# Altium project ETHERNET SWITCH LAYER 2.PrjPcb
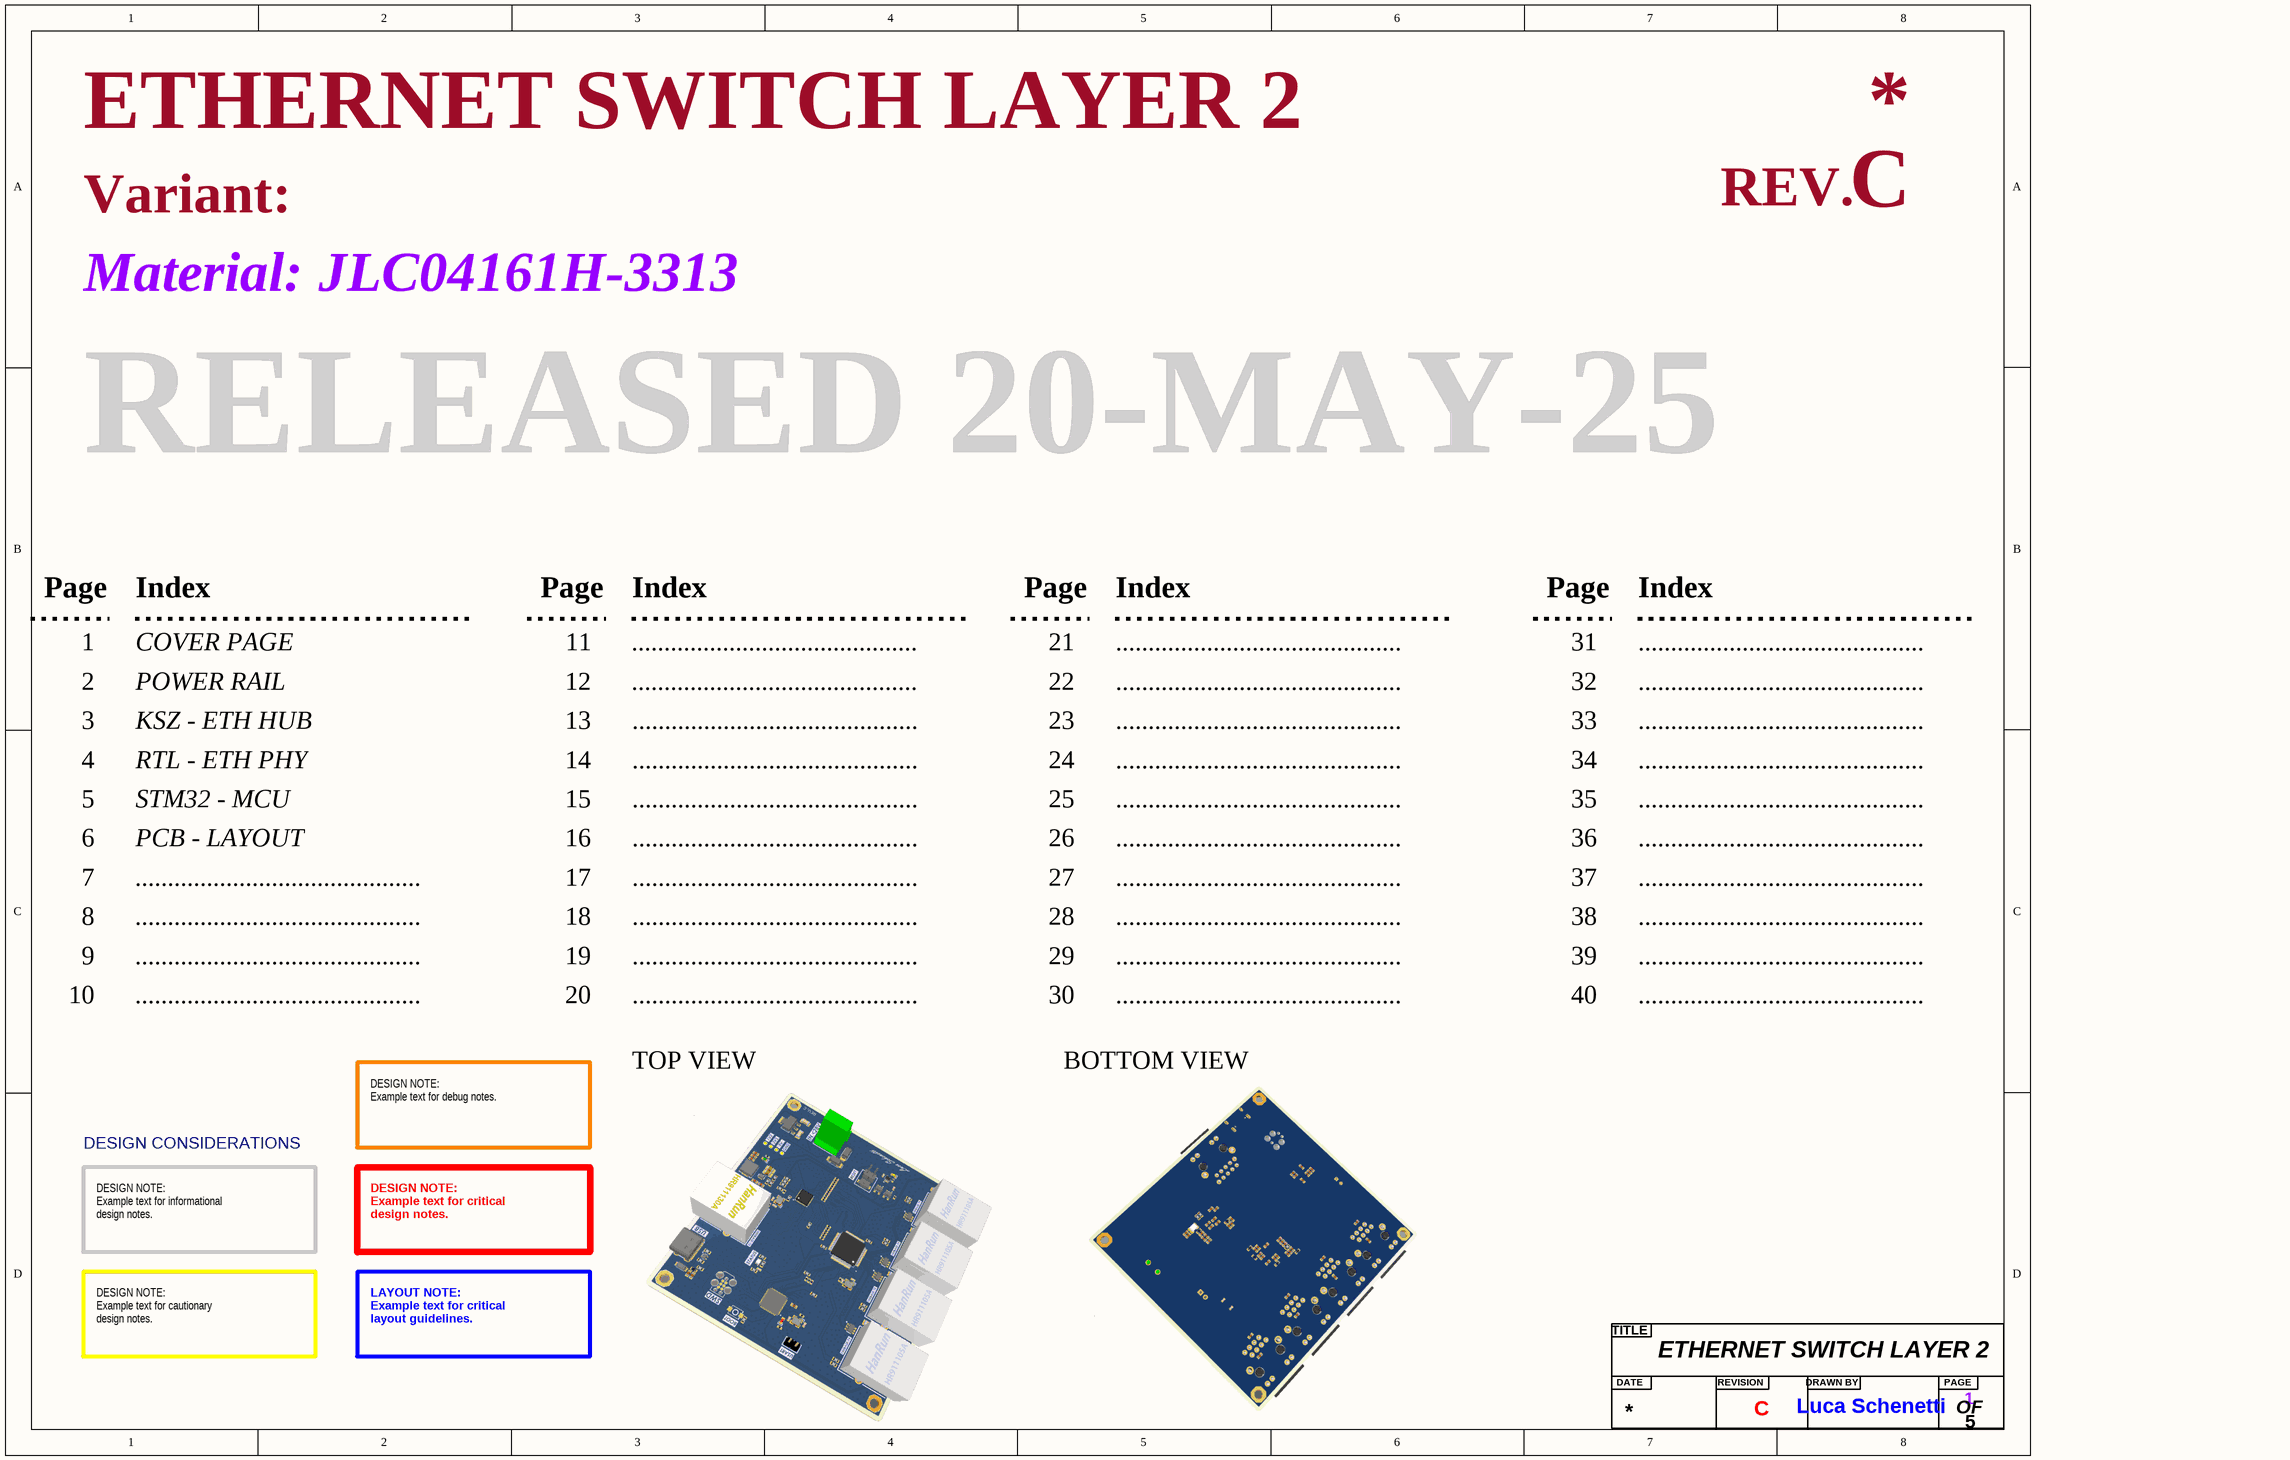
[diagram p0: COVER PAGE.SchDoc]
5 sheets, 184 parts. Net scope: flat (ports and power ports of the same name join across sheets).
Board file: PCB - LAYOUT.PcbDoc
Sheets:
  COVER PAGE.SchDoc
  POWER RAIL.SchDoc
  KSZ - ETH HUB.SchDoc
  RTL - ETH PHY.SchDoc
  STM32 - MCU.SchDoc

## Sheet COVER PAGE.SchDoc: ETHERNET SWITCH LAYER 2
size A3; DrawnBy: Luca Schenetti; Revision: C; SheetNumber: 1; SheetTotal: 5; Material: JLC04161H-3313

### Parts
(Parts that share a designator on the sheet are numbered #1, #2 ... from top to bottom, then left to right.)
?#1  Title  (value not drawn)  (graphical)

### Notes on the sheet
- Variant:
- REV.
- Material:
- RELEASED 20-MAY-25
- Page
- Index
- 1
- 2
- COVER PAGE
- POWER RAIL
- 11
- 12
- ............................................
- 21
- 22
- 31
- 32
- 3
- KSZ - ETH HUB
- 13
- 23
- 33
- 4
- 5
- RTL - ETH PHY
- STM32 - MCU
- 14
- 15
- 24
- 25
- 34
- 35
- 6
- 7
- PCB - LAYOUT
- 16
- 17
- 26
- 27
- 36
- 37
- 8
- 18
- 28
- 38
- 9
- 10
- 19
- 20
- 29
- 30
- 39
- 40
- TOP VIEW
- BOTTOM VIEW
- DESIGN CONSIDERATIONS
- DESIGN NOTE:
  Example text for debug notes.
- DESIGN NOTE:
  Example text for informational
  design notes.
- DESIGN NOTE:
  Example text for critical
  design notes.
- DESIGN NOTE:
  Example text for cautionary
  design notes.
- LAYOUT NOTE:
  Example text for critical
  layout guidelines.
- (in symbol Title) TITLE; DATE; REVISION; DRAWN BY; PAGE; OF

## Sheet POWER RAIL.SchDoc: ETHERNET SWITCH LAYER 2
size A4; DrawnBy: Luca Schenetti; Revision: C; SheetNumber: 2; SheetTotal: 5
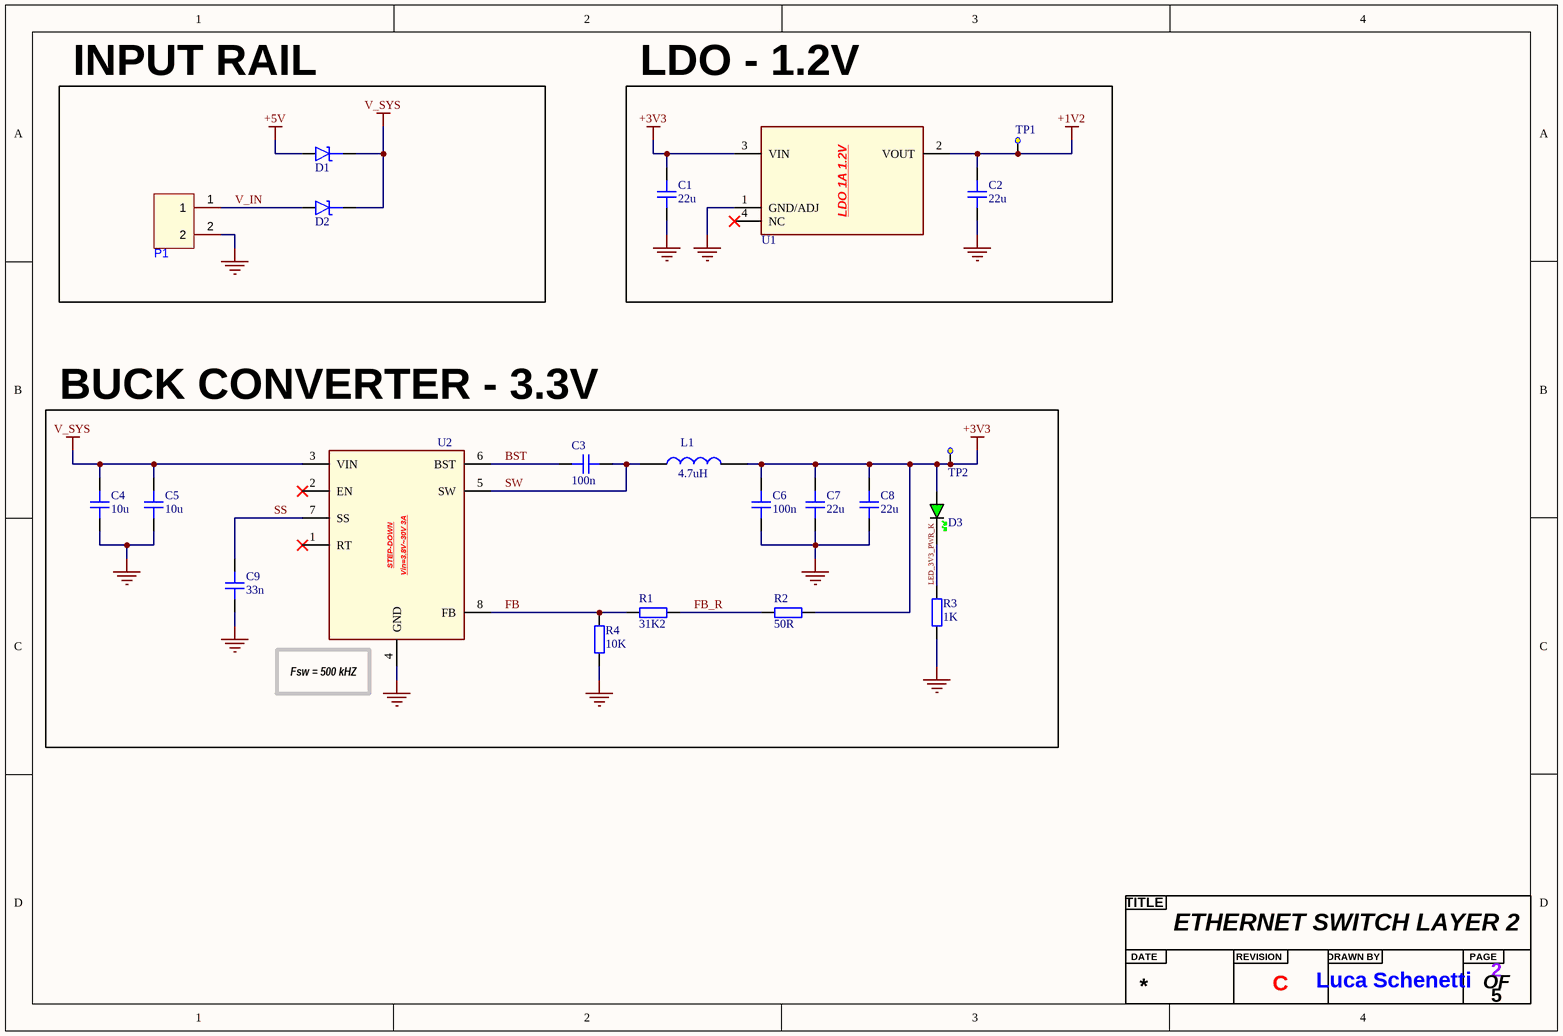
[diagram p1: POWER RAIL.SchDoc]

### Parts
(Parts that share a designator on the sheet are numbered #1, #2 ... from top to bottom, then left to right.)
?#2  Title  (value not drawn)  (graphical)
C1  22u  [CAP_1206]
C2  22u  [CAP_1206]
C3  100n  [CAP_0603]
C4  10u  [CAP_0805]
C5  10u  [CAP_0805]
C6  100n  [CAP_0603]
C7  22u  [CAP_0603]
C8  22u  [CAP_0603]
C9  33n  [CAP_0603]
D1  40V 3A SMA(DO-214AC)  [SS34]  (value not drawn)
D2  40V 3A SMA(DO-214AC)  [SS34]  (value not drawn)
D3  GREEN  [LED_0603_GREEN]  (value not drawn)
L1  4.7uH  [FXL0530-4R7-M]
P1  WJ500V-5.08-2P  [CONN-TH_2P-P5.00_WJ500V-5.08-2P]  (value not drawn)
R1  31K2  [RES_0603]
R2  50R  [RES_0603]
R3  1K  [RES_0402]
R4  10K  [RES_0603]
TP1  Test Point  [Test Point]  (value not drawn)
TP2  Test Point  [Test Point]  (value not drawn)
U1  LDO 1A 1.2V  [AMS1117-1.2]  (value not drawn)
U2  Step Down Converter 3A 3.8V~30V  [TPS62933DRLR]  (value not drawn)

### Blocks framed on the sheet
BUCK CONVERTER - 3.3V: C3-C9 D3 L1 R1-R4 TP2 U2

### Nets
+1V2: C2.2 TP1.1(Test_Point) U1.2(VOUT)
+3V3: C1.2 C6.1 C7.2 C8.2 D3.A L1.2 R2.1 TP2.1(Test_Point) U1.3(VIN)
+5V: D1.A
GND: C1.1 C2.1 C4.1 C5.1 C6.2 C7.1 C8.1 C9.2 P1.2 R3.1 R4.1 U1.1(GND/ADJ) U2.4(GND)
V_SYS: C4.2 C5.2 D1.K D2.K U2.3(VIN)
BST: C3.2 U2.6(BST)
FB: R1.2 R4.2 U2.8(FB)
FB_R: R1.1 R2.2
LED_3V3_PWR_K: D3.K R3.2
SS: C9.1 U2.7(SS)
SW: C3.1 L1.1 U2.5(SW)
V_IN: D2.A P1.1

Not connected (* = marked no-connect by the designer): U1 4(NC)*; U2 1(RT)* 2(EN)*

### Notes on the sheet
- INPUT RAIL
- LDO - 1.2V
- (near U2) Fsw = 500 kHZ
- (in symbol Title) TITLE; DATE; REVISION; DRAWN BY; PAGE; OF
- (in symbol TPS62933DRLR) STEP-DOWN; Vin=3.8V~30V 3A

### Library data of the parts
C1 C2 = CAP_1206: [C12891]; Manufacturer: *; Manufacturer Part Number: *; Distributor Link: *; LCSC: *; Rating: *; Dielectric: *
C3 C6 = CAP_0603: Capacitor SMD 0603 [C14663]; Manufacturer: *; Manufacturer Part Number: *; Distributor Link: *; LCSC: *; Rating: *; Dielectric: *
C4 C5 = CAP_0805: Capacitor SMD 0805[C440198]; Manufacturer: *; Manufacturer Part Number: *; Distributor Link: *; LCSC: *; Rating: *; Dielectric: *
C7 C8 = CAP_0603: Capacitor SMD 0603 [C59461]; Manufacturer: *; Manufacturer Part Number: *; Distributor Link: *; LCSC: *; Rating: *; Dielectric: *
C9 = CAP_0603: [C21117]; Manufacturer: *; Manufacturer Part Number: *; Distributor Link: *; LCSC: *; Rating: *; Dielectric: *
D1 D2 = SS34: [C8678]
D3 = LED_0603_GREEN: LED 0603 GREEN SMD[C2986059]
L1 = FXL0530-4R7-M: [C177246]
P1 = WJ500V-5.08-2P: [C8465]; Manufacturer: KANGNEX(康奈克斯电气); Symbol: WJ500V-5.08-2P-14-00A; Add into BOM: yes; Structure: 1x2P; Pitch: 5.08mm; Current Rating (Max): 18A; Voltage Rating (Max): 250V; Wire Gauge - AWG: 14~30; Wire Gauge - mm2: 2.5; Number of PINs Per Row: 2; Screw Specification: M2.5; Device: WJ500V-5.08-2P; LCSC Part Name: 1x2P 5.08mm 直插 排数:1 每排P数:2; Supplier Part: C8465; Manufacturer Part: WJ500V-5.08-2P; Supplier Footprint: 插件,P=5.08mm; JLCPCB Part Class: Extended Part; Datasheet: https://atta.szlcsc.com/upload/public/pdf/source/20191225/C8465_02D34CE5B5B4A53DF5891601D97FA9F4.pdf; Supplier: LCSC; Convert to PCB: yes; Color: Green; Mounting Style: Straight; Number of Pins: 2P; Number of Rows: 1; Contact Material: -; Contact Plating: -; Operating Temperature Range: -40℃~+105℃; Soldering Temperature(Max): -
R1 = RES_0603: [C863036]; Manufacturer: *; Manufacturer Part Number: *; Distributor Link: *; LCSC: *
R2 = RES_0603: [C849792]; Manufacturer: *; Manufacturer Part Number: *; Distributor Link: *; LCSC: *
R3 = RES_0402: Resistor SMD 0402 [C11702]; Manufacturer: *; Manufacturer Part Number: *; Distributor Link: *; LCSC: *
R4 = RES_0603: [C25804]; Manufacturer: *; Manufacturer Part Number: *; Distributor Link: *; LCSC: *
U1 = AMS1117-1.2: [C347218]
U2 = TPS62933DRLR: [C3200405]
TP1 TP2 = Test Point: Value: Test Point

## Sheet KSZ - ETH HUB.SchDoc: ETHERNET SWITCH LAYER 2
size A2; DrawnBy: Luca Schenetti; Revision: C; SheetNumber: 3; SheetTotal: 5
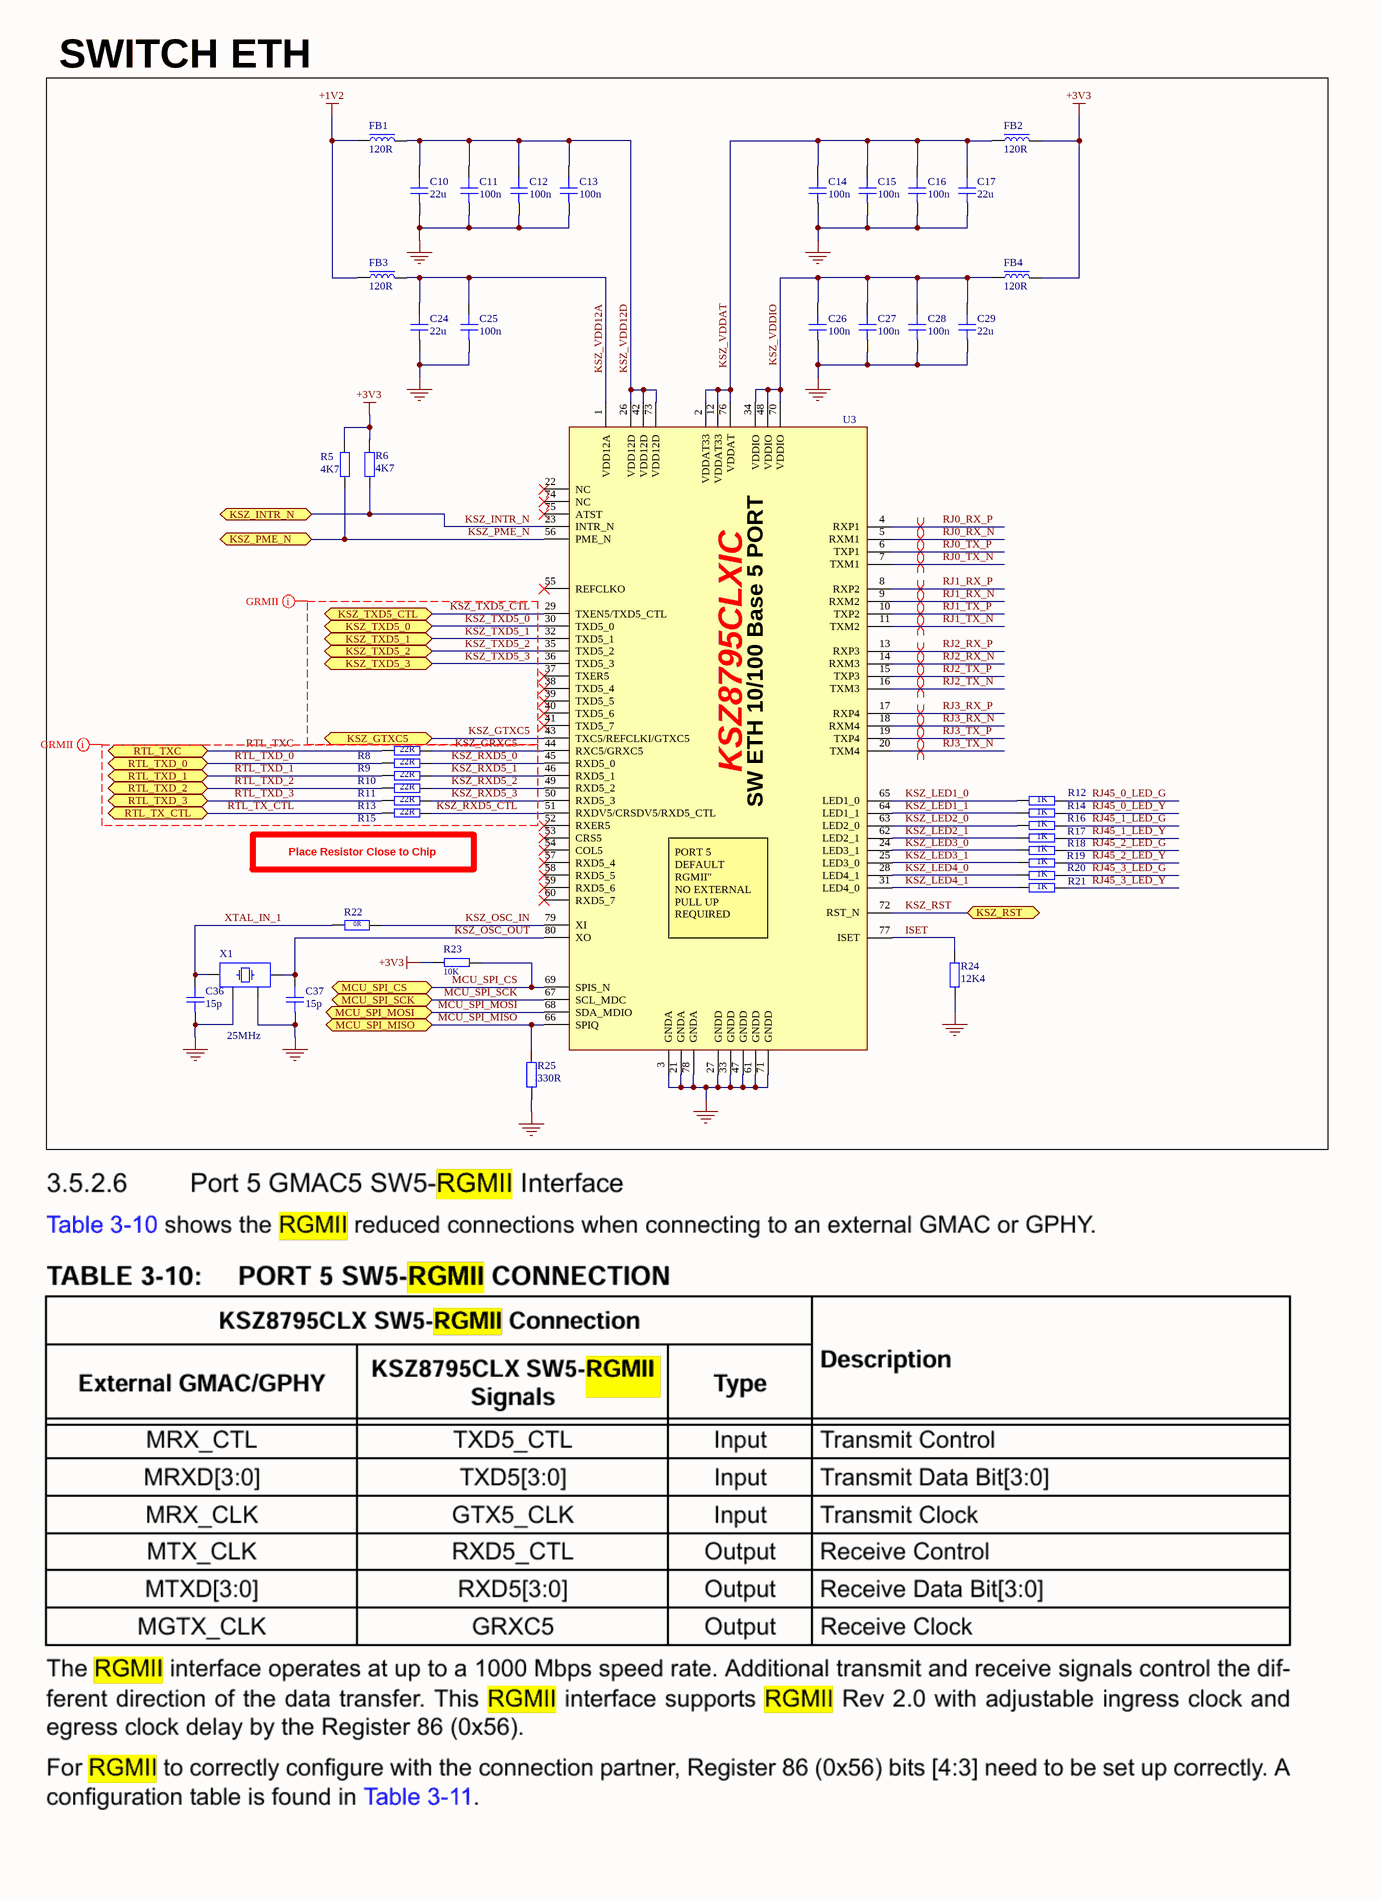
[diagram p2: KSZ - ETH HUB.SchDoc, left]
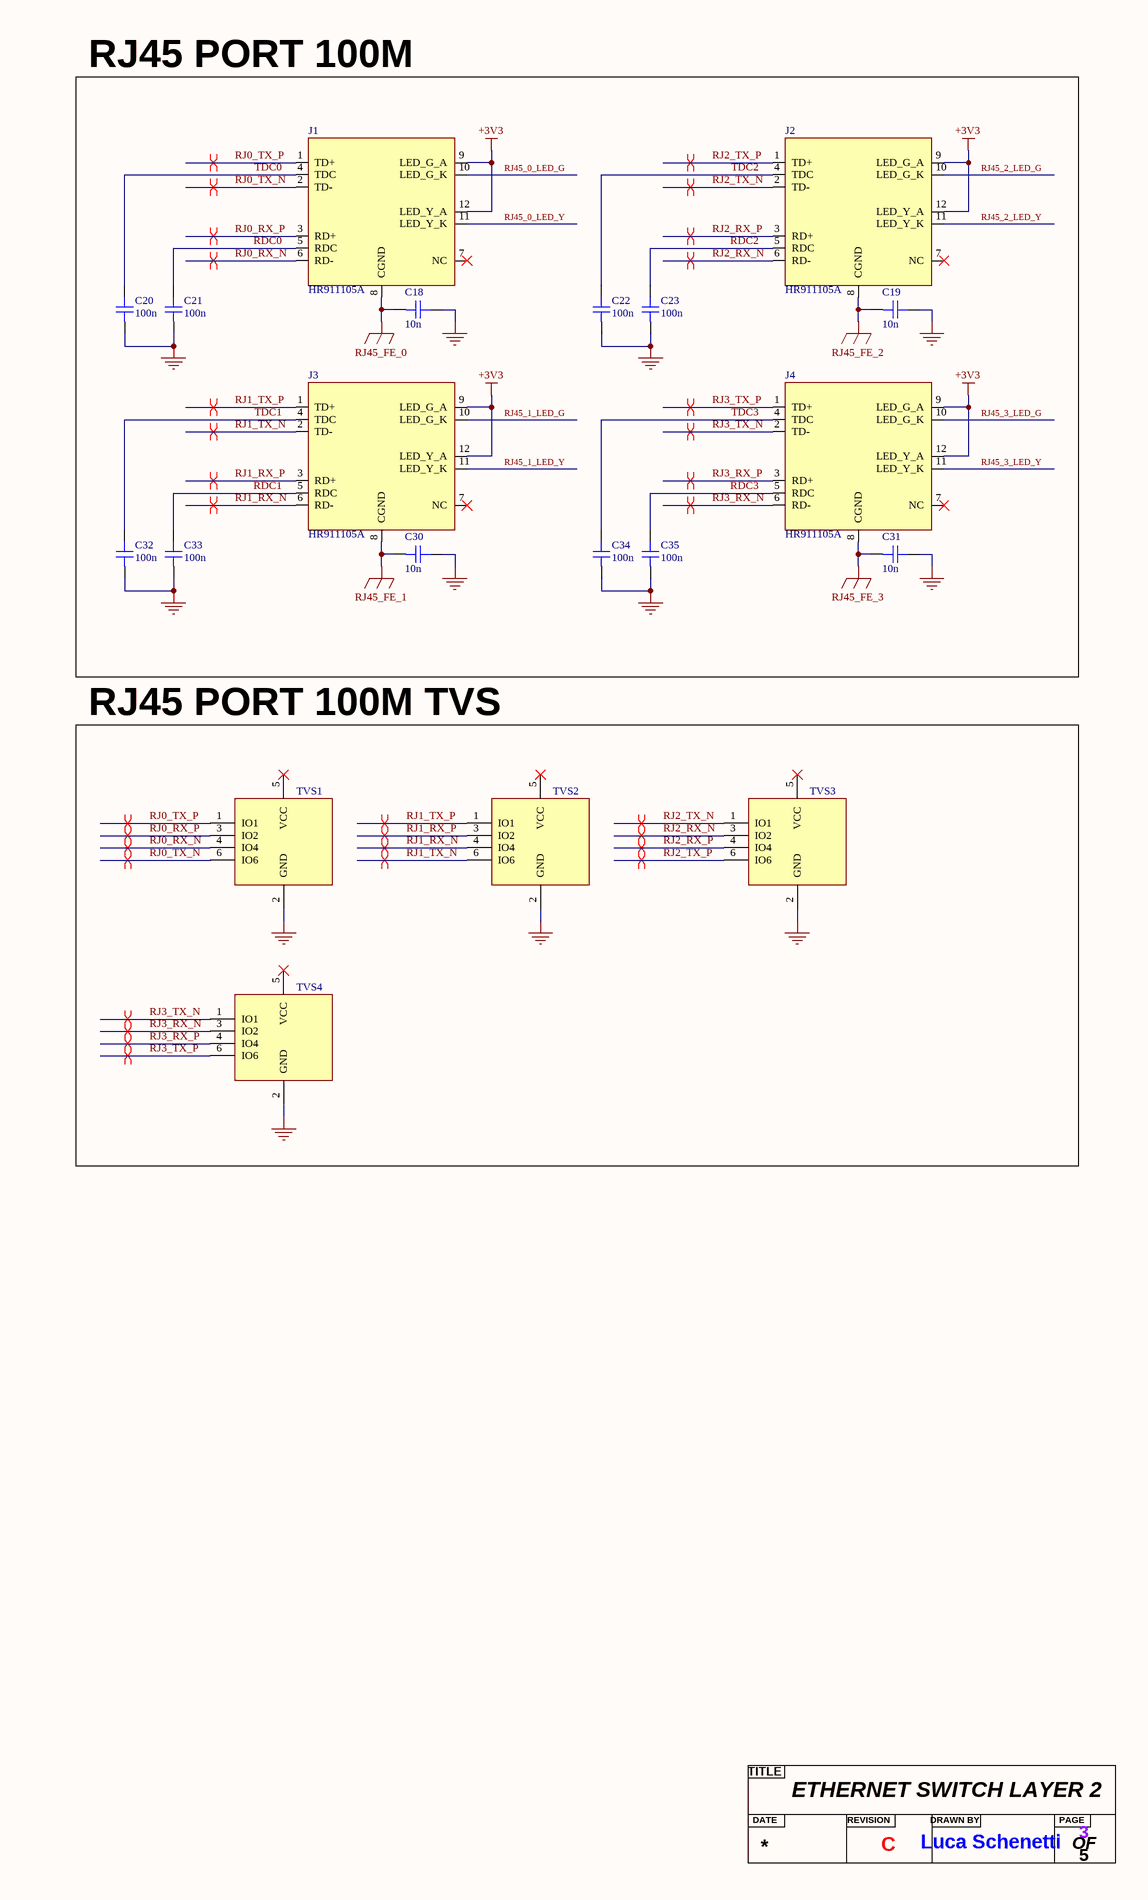
[diagram p3: KSZ - ETH HUB.SchDoc, right]

### Parts
(Parts that share a designator on the sheet are numbered #1, #2 ... from top to bottom, then left to right.)
?#3  Title  (value not drawn)  (graphical)
C10  22u  [CAP_0603]
C11  100n  [CAP_0603]
C12  100n  [CAP_0603]
C13  100n  [CAP_0603]
C14  100n  [CAP_0603]
C15  100n  [CAP_0603]
C16  100n  [CAP_0603]
C17  22u  [CAP_0603]
C18  10n  [CAP_1206]
C19  10n  [CAP_1206]
C20  100n  [CAP_0603]
C21  100n  [CAP_0603]
C22  100n  [CAP_0603]
C23  100n  [CAP_0603]
C24  22u  [CAP_0603]
C25  100n  [CAP_0603]
C26  100n  [CAP_0603]
C27  100n  [CAP_0603]
C28  100n  [CAP_0603]
C29  22u  [CAP_0603]
C30  10n  [CAP_1206]
C31  10n  [CAP_1206]
C32  100n  [CAP_0603]
C33  100n  [CAP_0603]
C34  100n  [CAP_0603]
C35  100n  [CAP_0603]
C36  15p  [CAP_0402]
C37  15p  [CAP_0402]
FB1  120R  [FB_0603]
FB2  120R  [FB_0603]
FB3  120R  [FB_0603]
FB4  120R  [FB_0603]
J1  HR911105A  [HR911105A]
J2  HR911105A  [HR911105A]
J3  HR911105A  [HR911105A]
J4  HR911105A  [HR911105A]
R5  4K7  [RES_0603]
R6  4K7  [RES_0603]
R8  22R  [RES_0402]
R9  22R  [RES_0402]
R10  22R  [RES_0402]
R11  22R  [RES_0402]
R12  1K  [RES_0603]
R13  22R  [RES_0402]
R14  1K  [RES_0603]
R15  22R  [RES_0402]
R16  1K  [RES_0603]
R17  1K  [RES_0603]
R18  1K  [RES_0603]
R19  1K  [RES_0603]
R20  1K  [RES_0603]
R21  1K  [RES_0603]
R22  0R  [RES_0402]
R23  10K  [RES_0603]
R24  12K4  [RES_0603]
R25  330R  [RES_0603]
TVS1  ESD 5A 75W 12.5V 6V Bidirectional 5V  [SRV05-4]  (value not drawn)
TVS2  ESD 5A 75W 12.5V 6V Bidirectional 5V  [SRV05-4]  (value not drawn)
TVS3  ESD 5A 75W 12.5V 6V Bidirectional 5V  [SRV05-4]  (value not drawn)
TVS4  ESD 5A 75W 12.5V 6V Bidirectional 5V  [SRV05-4]  (value not drawn)
U3  5-Port 10/100-Man Eth  [KSZ8795CLXIC]  (value not drawn)
X1  25MHz  [XTAL_3225]

### Blocks framed on the sheet
SWITCH ETH: C10-C17 C24-C29 C36 C37 FB1-FB4 R5 R6 R8-R25 U3 X1
RJ45 PORT 100M: C18-C23 C30-C35 J1-J4

### Ports
KSZ_GTXC5 (bidir, see RTL - ETH PHY[1B]), KSZ_INTR_N (bidir, see STM32 - MCU[4D]), KSZ_PME_N (bidir, see STM32 - MCU[4D]), KSZ_RST (bidir, see STM32 - MCU[8C]), KSZ_TXD5_0 (bidir, see RTL - ETH PHY[1B]), KSZ_TXD5_1 (bidir, see RTL - ETH PHY[1B]), KSZ_TXD5_2 (bidir, see RTL - ETH PHY[1B]), KSZ_TXD5_3 (bidir, see RTL - ETH PHY[1B]), KSZ_TXD5_CTL (bidir, see RTL - ETH PHY[1B]), MCU_SPI_CS (bidir, see STM32 - MCU[1C]), MCU_SPI_MISO (bidir, see STM32 - MCU[1C]), MCU_SPI_MOSI (bidir, see STM32 - MCU[1C]), MCU_SPI_SCK (bidir, see STM32 - MCU[1C]), RTL_TX_CTL (bidir, see RTL - ETH PHY[3B]), RTL_TXC (bidir, see RTL - ETH PHY[3B]), RTL_TXD_0 (bidir, see RTL - ETH PHY[3B]), RTL_TXD_1 (bidir, see RTL - ETH PHY[3B]), RTL_TXD_2 (bidir, see RTL - ETH PHY[3B]), RTL_TXD_3 (bidir, see RTL - ETH PHY[3B])

### Nets
+1V2: FB1.1 FB3.1
+3V3: FB2.2 FB4.2 J1.9(LED_G_A) J1.12(LED_Y_A) J2.9(LED_G_A) J2.12(LED_Y_A) J3.9(LED_G_A) J3.12(LED_Y_A) J4.9(LED_G_A) J4.12(LED_Y_A) R5.2 R6.2 R23.2
GND: C10.1 C11.1 C12.1 C13.1 C14.1 C15.1 C16.1 C17.1 C18.2 C19.2 C20.1 C21.1 C22.1 C23.1 C24.1 C25.1 C26.1 C27.1 C28.1 C29.1 C30.2 C31.2 C32.1 C33.1 C34.1 C35.1 C36.1 C37.1 R24.1 R25.1 TVS1.2(GND) TVS2.2(GND) TVS3.2(GND) TVS4.2(GND) U3.3(GNDA) U3.21(GNDA) U3.27(GNDD) U3.33(GNDD) U3.47(GNDD) U3.61(GNDD) U3.71(GNDD) U3.78(GNDA) X1.2 X1.4
RJ45_FE_0: C18.1 J1.8(CGND)
RJ45_FE_1: C30.1 J3.8(CGND)
RJ45_FE_2: C19.1 J2.8(CGND)
RJ45_FE_3: C31.1 J4.8(CGND)
ISET: R24.2 U3.77(ISET)
KSZ_GRXC5: R8.2 U3.44(RXC5/GRXC5)
KSZ_GTXC5: U3.43(TXC5/REFCLKI/GTXC5) ; port KSZ_GTXC5
KSZ_INTR_N: R6.1 U3.23(INTR_N) ; port KSZ_INTR_N
KSZ_LED1_0: R14.2 U3.65(LED1_0)
KSZ_LED1_1: R12.2 U3.64(LED1_1)
KSZ_LED2_0: R16.2 U3.63(LED2_0)
KSZ_LED2_1: R17.2 U3.62(LED2_1)
KSZ_LED3_0: R18.2 U3.24(LED3_1)
KSZ_LED3_1: R19.2 U3.25(LED3_0)
KSZ_LED4_0: R20.2 U3.28(LED4_1)
KSZ_LED4_1: R21.2 U3.31(LED4_0)
KSZ_OSC_IN: R22.2 U3.79(XI)
KSZ_OSC_OUT: C37.2 U3.80(XO) X1.1
KSZ_PME_N: R5.1 U3.56(PME_N) ; port KSZ_PME_N
KSZ_RST: U3.72(RST_N) ; port KSZ_RST
KSZ_RXD5_0: R9.2 U3.45(RXD5_0)
KSZ_RXD5_1: R10.2 U3.46(RXD5_1)
KSZ_RXD5_2: R11.2 U3.49(RXD5_2)
KSZ_RXD5_3: R13.2 U3.50(RXD5_3)
KSZ_RXD5_CTL: R15.2 U3.51(RXDV5/CRSDV5/RXD5_CTL)
KSZ_TXD5_0: U3.30(TXD5_0) ; port KSZ_TXD5_0
KSZ_TXD5_1: U3.32(TXD5_1) ; port KSZ_TXD5_1
KSZ_TXD5_2: U3.35(TXD5_2) ; port KSZ_TXD5_2
KSZ_TXD5_3: U3.36(TXD5_3) ; port KSZ_TXD5_3
KSZ_TXD5_CTL: U3.29(TXEN5/TXD5_CTL) ; port KSZ_TXD5_CTL
KSZ_VDD12A: C24.2 C25.2 FB3.2 U3.1(VDD12A)
KSZ_VDD12D: C10.2 C11.2 C12.2 C13.2 FB1.2 U3.26(VDD12D) U3.42(VDD12D) U3.73(VDD12D)
KSZ_VDDAT: C14.2 C15.2 C16.2 C17.2 FB2.1 U3.2(VDDAT33) U3.12(VDDAT33) U3.76(VDDAT)
KSZ_VDDIO: C26.2 C27.2 C28.2 C29.2 FB4.1 U3.34(VDDIO) U3.48(VDDIO) U3.70(VDDIO)
MCU_SPI_CS: R23.1 U3.69(SPIS_N) ; port MCU_SPI_CS
MCU_SPI_MISO: R25.2 U3.66(SPIQ) ; port MCU_SPI_MISO
MCU_SPI_MOSI: U3.68(SDA_MDIO) ; port MCU_SPI_MOSI
MCU_SPI_SCK: U3.67(SCL_MDC) ; port MCU_SPI_SCK
RDC0: C21.2 J1.5(RDC)
RDC1: C33.2 J3.5(RDC)
RDC2: C23.2 J2.5(RDC)
RDC3: C35.2 J4.5(RDC)
RJ0_RX_N: J1.6(RD-) TVS1.4(IO4) U3.5(RXM1)
RJ0_RX_P: J1.3(RD+) TVS1.3(IO2) U3.4(RXP1)
RJ0_TX_N: J1.2(TD-) TVS1.6(IO6) U3.7(TXM1)
RJ0_TX_P: J1.1(TD+) TVS1.1(IO1) U3.6(TXP1)
RJ1_RX_N: J3.6(RD-) TVS2.4(IO4) U3.9(RXM2)
RJ1_RX_P: J3.3(RD+) TVS2.3(IO2) U3.8(RXP2)
RJ1_TX_N: J3.2(TD-) TVS2.6(IO6) U3.11(TXM2)
RJ1_TX_P: J3.1(TD+) TVS2.1(IO1) U3.10(TXP2)
RJ2_RX_N: J2.6(RD-) TVS3.3(IO2) U3.14(RXM3)
RJ2_RX_P: J2.3(RD+) TVS3.4(IO4) U3.13(RXP3)
RJ2_TX_N: J2.2(TD-) TVS3.1(IO1) U3.16(TXM3)
RJ2_TX_P: J2.1(TD+) TVS3.6(IO6) U3.15(TXP3)
RJ3_RX_N: J4.6(RD-) TVS4.3(IO2) U3.18(RXM4)
RJ3_RX_P: J4.3(RD+) TVS4.4(IO4) U3.17(RXP4)
RJ3_TX_N: J4.2(TD-) TVS4.1(IO1) U3.20(TXM4)
RJ3_TX_P: J4.1(TD+) TVS4.6(IO6) U3.19(TXP4)
RJ45_0_LED_G: J1.10(LED_G_K) R14.1
RJ45_0_LED_Y: J1.11(LED_Y_K) R12.1
RJ45_1_LED_G: J3.10(LED_G_K) R16.1
RJ45_1_LED_Y: J3.11(LED_Y_K) R17.1
RJ45_2_LED_G: J2.10(LED_G_K) R18.1
RJ45_2_LED_Y: J2.11(LED_Y_K) R19.1
RJ45_3_LED_G: J4.10(LED_G_K) R20.1
RJ45_3_LED_Y: J4.11(LED_Y_K) R21.1
RTL_TX_CTL: R15.1 ; port RTL_TX_CTL
RTL_TXC: R8.1 ; port RTL_TXC
RTL_TXD_0: R9.1 ; port RTL_TXD_0
RTL_TXD_1: R10.1 ; port RTL_TXD_1
RTL_TXD_2: R11.1 ; port RTL_TXD_2
RTL_TXD_3: R13.1 ; port RTL_TXD_3
TDC0: C20.2 J1.4(TDC)
TDC1: C32.2 J3.4(TDC)
TDC2: C22.2 J2.4(TDC)
TDC3: C34.2 J4.4(TDC)
XTAL_IN_1: C36.2 R22.1 X1.3

Not connected (* = marked no-connect by the designer): J1 7(NC)*; J2 7(NC)*; J3 7(NC)*; J4 7(NC)*; TVS1 5(VCC)*; TVS2 5(VCC)*; TVS3 5(VCC)*; TVS4 5(VCC)*; U3 22(NC)* 37(TXER5)* 38(TXD5_4)* 39(TXD5_5)* 40(TXD5_6)* 41(TXD5_7)* 52(RXER5)* 53(CRS5)* 54(COL5)* 55(REFCLKO)* 57(RXD5_4)* 58(RXD5_5)* 59(RXD5_6)* 60(RXD5_7)* 74(NC)* 75(ATST)*

### Layout directives
differential pair; differential pair class DIFF_MDI_100Ω: RJ0_RX_N, RJ0_RX_P, RJ0_TX_N, RJ0_TX_P, RJ1_RX_N, RJ1_RX_P, RJ1_TX_N, RJ1_TX_P, RJ2_RX_N, RJ2_RX_P, RJ2_TX_N, RJ2_TX_P, RJ3_RX_N, RJ3_RX_P, RJ3_TX_N, RJ3_TX_P
net class GRMII_RX; rule Matched Net Lengths [Delay Tolerance = 20ps]: KSZ_GTXC5, KSZ_TXD5_0, KSZ_TXD5_1, KSZ_TXD5_2, KSZ_TXD5_3, KSZ_TXD5_CTL
net class GRMII_TX; rule Matched Net Lengths [Delay Tolerance = 20ps]: KSZ_GRXC5, KSZ_RXD5_0, KSZ_RXD5_1, KSZ_RXD5_2, KSZ_RXD5_3, KSZ_RXD5_CTL, RTL_TX_CTL, RTL_TXC, RTL_TXD_0, RTL_TXD_1, RTL_TXD_2, RTL_TXD_3

### Notes on the sheet
- RJ45 PORT 100M TVS
- Place Resistor Close to Chip
- (near U3) PORT 5 DEFAULT RGMII"
  NO EXTERNAL PULL UP REQUIRED
- (in symbol KSZ8795CLXIC) SW ETH 10/100 Base 5 PORT
- (in symbol Title) TITLE; DATE; REVISION; DRAWN BY; PAGE; OF

### Library data of the parts
C10 C17 C24 C29 = CAP_0603: Capacitor SMD 0603 [C59461]; Manufacturer: *; Manufacturer Part Number: *; Distributor Link: *; LCSC: *; Rating: *; Dielectric: *
C11-C16 C20-C23 C25-C28 C32-C35 = CAP_0603: Capacitor SMD 0603 [C14663]; Manufacturer: *; Manufacturer Part Number: *; Distributor Link: *; LCSC: *; Rating: *; Dielectric: *
C18 C19 C30 C31 = CAP_1206: [C1846]; Manufacturer: *; Manufacturer Part Number: *; Distributor Link: *; LCSC: *; Rating: *; Dielectric: *
C36 C37 = CAP_0402: Capacitor SMD 0402 [C1548]; Manufacturer: *; Manufacturer Part Number: *; Distributor Link: *; LCSC: *; Rating: *; Dielectric: *
FB1-FB4 = FB_0603: Ferrite Bead SMD 0603[C76892]; Manufacturer: *; Manufacturer Part Number: *; Distributor Link: *; LCSC: *
J1-J4 = HR911105A: Single Port RJ45 Connector w/ Integrated Magnetic and LED 10/100 Base-T [C12074]; Manufacturer: HanRun; Manufacturer Part Number: HR911105A
R5 R6 = RES_0603: [C23162]; Manufacturer: *; Manufacturer Part Number: *; Distributor Link: *; LCSC: *
R8-R11 R13 R15 = RES_0402: [C25092]; Manufacturer: *; Manufacturer Part Number: *; Distributor Link: *; LCSC: *
R12 R14 R16-R21 = RES_0603: [C21190]; Manufacturer: *; Manufacturer Part Number: *; Distributor Link: *; LCSC: *
R22 = RES_0402: Resistor SMD 0402 [C17168]; Manufacturer: *; Manufacturer Part Number: *; Distributor Link: *; LCSC: *
R23 = RES_0603: [C25804]; Manufacturer: *; Manufacturer Part Number: *; Distributor Link: *; LCSC: *
R24 = RES_0603: [C22865]; Manufacturer: *; Manufacturer Part Number: *; Distributor Link: *; LCSC: *
R25 = RES_0603: [C23138]; Manufacturer: *; Manufacturer Part Number: *; Distributor Link: *; LCSC: *
TVS1-TVS4 = SRV05-4: [C7420376]
U3 = KSZ8795CLXIC: [C69416]
X1 = TSX-3225_24.0000MF15X-AC: Crystal SMD 24MHz 10PPM 7pF 3225 [C9006]; Manufacturer: Epson; Manufacturer Part Number: TSX-3225 24.0000MF15X-AC

## Sheet RTL - ETH PHY.SchDoc: ETHERNET SWITCH LAYER 2
size A3; DrawnBy: Luca Schenetti; Revision: C; SheetNumber: 4; SheetTotal: 5
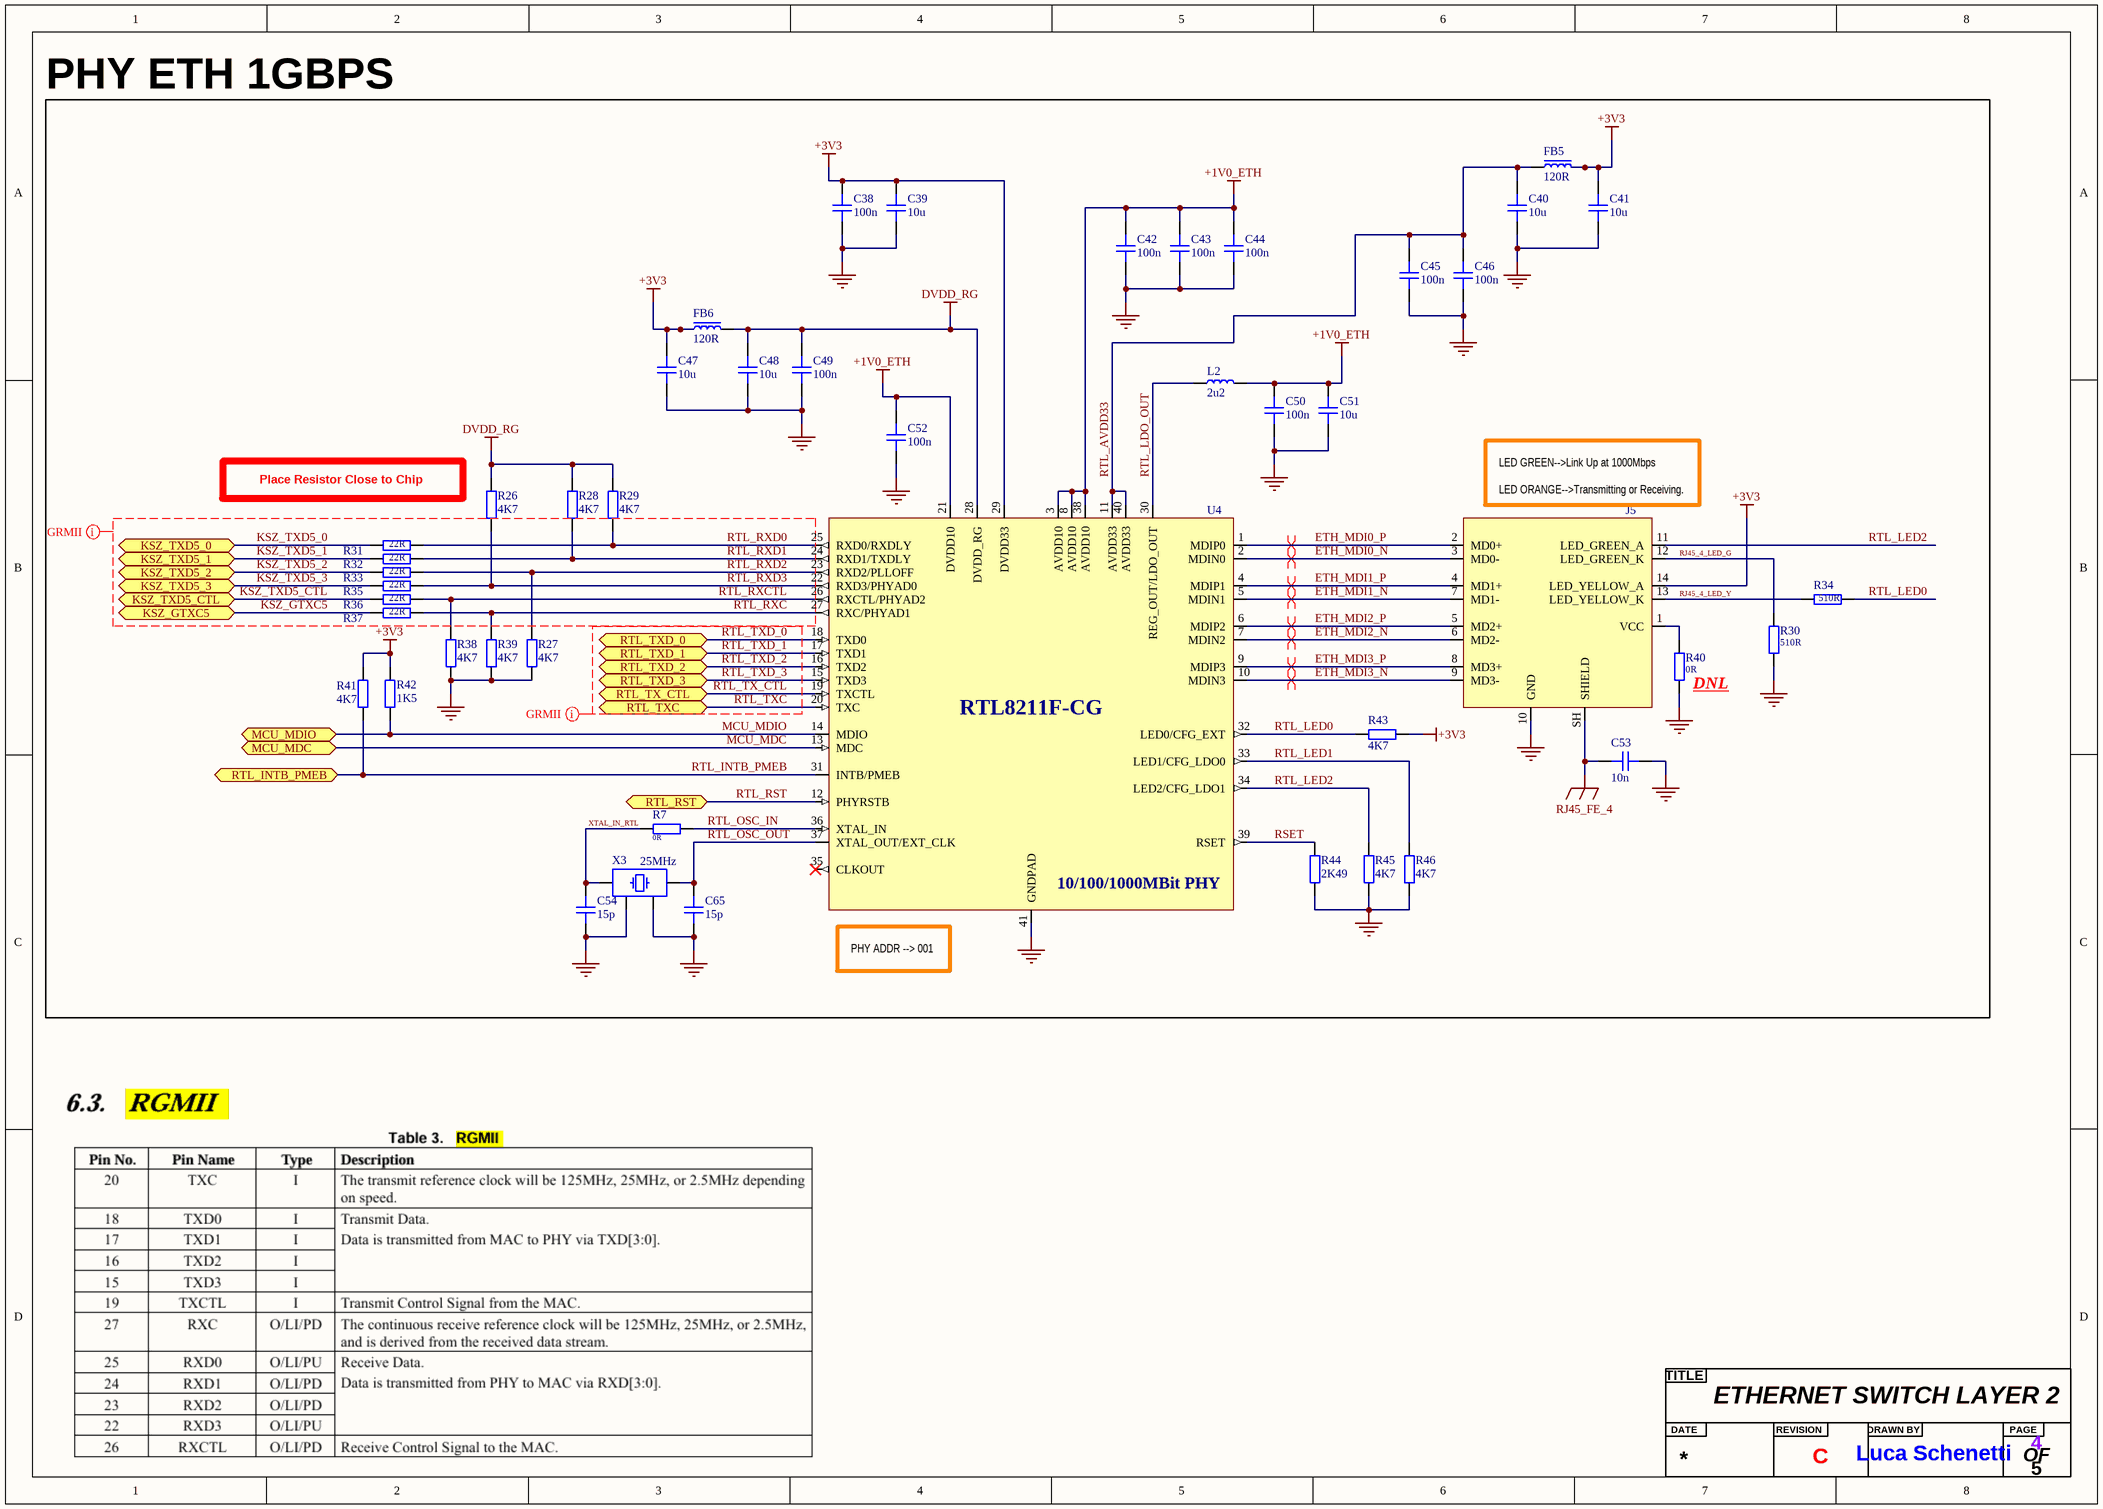
[diagram p4: RTL - ETH PHY.SchDoc]

### Parts
(Parts that share a designator on the sheet are numbered #1, #2 ... from top to bottom, then left to right.)
?#4  Title  (value not drawn)  (graphical)
C38  100n  [CAP_0603]
C39  10u  [CAP_0603]
C40  10u  [CAP_0603]
C41  10u  [CAP_0603]
C42  100n  [CAP_0603]
C43  100n  [CAP_0603]
C44  100n  [CAP_0603]
C45  100n  [CAP_0603]
C46  100n  [CAP_0603]
C47  10u  [CAP_0603]
C48  10u  [CAP_0603]
C49  100n  [CAP_0603]
C50  100n  [CAP_0603]
C51  10u  [CAP_0603]
C52  100n  [CAP_0603]
C53  10n  [CAP_1206]
C54  15p  [CAP_0402]
C65  15p  [CAP_0402]
FB5  120R  [FB_0603]
FB6  120R  [FB_0603]
J5  100/1000Base-T RJ45 MAGJACK  [HR911130A]  (value not drawn)
L2  2u2  [IND_1008]
R7  0R  [RES_0402]
R26  4K7  [RES_0402]
R27  4K7  [RES_0402]
R28  4K7  [RES_0402]
R29  4K7  [RES_0402]
R30  510R  [RES_0603]
R31  22R  [RES_0402]
R32  22R  [RES_0402]
R33  22R  [RES_0402]
R34  510R  [RES_0603]
R35  22R  [RES_0402]
R36  22R  [RES_0402]
R37  22R  [RES_0402]
R38  4K7  [RES_0402]
R39  4K7  [RES_0402]
R40  0R  [RES_0402]
R41  4K7  [RES_0603]
R42  1K5  [RES_0603]
R43  4K7  [RES_0603]
R44  2K49  [RES_0603]
R45  4K7  [RES_0603]
R46  4K7  [RES_0603]
U4  PHY ETH 10/100/1000M  [RTL8211F-CG]  (value not drawn)
X3  25MHz  [XTAL_3225]

### Blocks framed on the sheet
PHY ETH 1GBPS: C38-C54 C65 FB5 FB6 J5 L2 R7 R26-R46 U4 X3

### Ports
KSZ_GTXC5 (bidir, see KSZ - ETH HUB[2B]), KSZ_TXD5_0 (bidir, see KSZ - ETH HUB[2B]), KSZ_TXD5_1 (bidir, see KSZ - ETH HUB[2B]), KSZ_TXD5_2 (bidir, see KSZ - ETH HUB[2B]), KSZ_TXD5_3 (bidir, see KSZ - ETH HUB[2B]), KSZ_TXD5_CTL (bidir, see KSZ - ETH HUB[2B]), MCU_MDC (bidir, see STM32 - MCU[4C]), MCU_MDIO (bidir, see STM32 - MCU[4C]), RTL_INTB_PMEB (bidir, see STM32 - MCU[2C]), RTL_RST (bidir, see STM32 - MCU[8C]), RTL_TX_CTL (bidir, see KSZ - ETH HUB[1B]), RTL_TXC (bidir, see KSZ - ETH HUB[1B]), RTL_TXD_0 (bidir, see KSZ - ETH HUB[1B]), RTL_TXD_1 (bidir, see KSZ - ETH HUB[1B]), RTL_TXD_2 (bidir, see KSZ - ETH HUB[1B]), RTL_TXD_3 (bidir, see KSZ - ETH HUB[1B])

### Nets
+1V0_ETH: C42.2 C43.2 C44.2 C50.2 C51.2 C52.2 L2.2 U4.3(AVDD10) U4.8(AVDD10) U4.21(DVDD10) U4.38(AVDD10)
+3V3: C38.2 C39.2 C41.2 C47.2 FB5.2 FB6.2 J5.14(LED_YELLOW_A) R41.2 R42.2 R43.1 U4.29(DVDD33)
DVDD_RG: C48.2 C49.2 FB6.1 R26.2 R28.2 R29.2 U4.28(DVDD_RG)
GND: C38.1 C39.1 C40.1 C41.1 C42.1 C43.1 C44.1 C45.1 C46.1 C47.1 C48.1 C49.1 C50.1 C51.1 C52.1 C53.2 C54.1 C65.1 J5.10(GND) R27.1 R30.2 R38.1 R39.1 R40.1 R44.2 R45.2 R46.2 U4.41(GNDPAD) X3.2 X3.4
RJ45_FE_4: C53.1 J5.SH(SHIELD)
ETH_MDI0_N: J5.3(MD0-) U4.2(MDIN0)
ETH_MDI0_P: J5.2(MD0+) U4.1(MDIP0)
ETH_MDI1_N: J5.7(MD1-) U4.5(MDIN1)
ETH_MDI1_P: J5.4(MD1+) U4.4(MDIP1)
ETH_MDI2_N: J5.6(MD2-) U4.7(MDIN2)
ETH_MDI2_P: J5.5(MD2+) U4.6(MDIP2)
ETH_MDI3_N: J5.9(MD3-) U4.10(MDIN3)
ETH_MDI3_P: J5.8(MD3+) U4.9(MDIP3)
KSZ_GTXC5: R37.1 ; port KSZ_GTXC5
KSZ_TXD5_0: R31.1 ; port KSZ_TXD5_0
KSZ_TXD5_1: R32.1 ; port KSZ_TXD5_1
KSZ_TXD5_2: R33.1 ; port KSZ_TXD5_2
KSZ_TXD5_3: R35.1 ; port KSZ_TXD5_3
KSZ_TXD5_CTL: R36.1 ; port KSZ_TXD5_CTL
MCU_MDC: U4.13(MDC) ; port MCU_MDC
MCU_MDIO: R42.1 U4.14(MDIO) ; port MCU_MDIO
RJ45_4_LED_G: J5.12(LED_GREEN_K) R30.1
RJ45_4_LED_Y: J5.13(LED_YELLOW_K) R34.2
RSET: R44.1 U4.39(RSET)
RTL_AVDD33: C40.2 C45.2 C46.2 FB5.1 U4.11(AVDD33) U4.40(AVDD33)
RTL_INTB_PMEB: R41.1 U4.31(INTB/PMEB) ; port RTL_INTB_PMEB
RTL_LDO_OUT: L2.1 U4.30(REG_OUT/LDO_OUT)
RTL_LED0: R34.1 R43.2 U4.32(LED0/CFG_EXT)
RTL_LED1: R46.1 U4.33(LED1/CFG_LDO0)
RTL_LED2: J5.11(LED_GREEN_A) R45.1 U4.34(LED2/CFG_LDO1)
RTL_OSC_IN: R7.2 U4.36(XTAL_IN)
RTL_OSC_OUT: C65.2 U4.37(XTAL_OUT/EXT_CLK) X3.1
RTL_RST: U4.12(PHYRSTB) ; port RTL_RST
RTL_RXC: R37.2 R39.2 U4.27(RXC/PHYAD1)
RTL_RXCTL: R36.2 R38.2 U4.26(RXCTL/PHYAD2)
RTL_RXD0: R29.1 R31.2 U4.25(RXD0/RXDLY)
RTL_RXD1: R28.1 R32.2 U4.24(RXD1/TXDLY)
RTL_RXD2: R27.2 R33.2 U4.23(RXD2/PLLOFF)
RTL_RXD3: R26.1 R35.2 U4.22(RXD3/PHYAD0)
RTL_TX_CTL: U4.19(TXCTL) ; port RTL_TX_CTL
RTL_TXC: U4.20(TXC) ; port RTL_TXC
RTL_TXD_0: U4.18(TXD0) ; port RTL_TXD_0
RTL_TXD_1: U4.17(TXD1) ; port RTL_TXD_1
RTL_TXD_2: U4.16(TXD2) ; port RTL_TXD_2
RTL_TXD_3: U4.15(TXD3) ; port RTL_TXD_3
XTAL_IN_RTL: C54.2 R7.1 X3.3
NetJ5_1: J5.1(VCC) R40.2

Not connected (* = marked no-connect by the designer): U4 35(CLKOUT)*

### Layout directives
differential pair; differential pair class DIFF_MDI_100Ω: ETH_MDI0_N, ETH_MDI0_P, ETH_MDI1_N, ETH_MDI1_P, ETH_MDI2_N, ETH_MDI2_P, ETH_MDI3_N, ETH_MDI3_P
net class GRMII_RX; rule Matched Net Lengths [Delay Tolerance = 20ps]: KSZ_GTXC5, KSZ_TXD5_0, KSZ_TXD5_1, KSZ_TXD5_2, KSZ_TXD5_3, KSZ_TXD5_CTL, RTL_RXC, RTL_RXCTL, RTL_RXD0, RTL_RXD1, RTL_RXD2, RTL_RXD3
net class GRMII_TX; rule Matched Net Lengths [Delay Tolerance = 20ps]: RTL_TX_CTL, RTL_TXC, RTL_TXD_0, RTL_TXD_1, RTL_TXD_2, RTL_TXD_3

### Notes on the sheet
- Place Resistor Close to Chip
- (near J5) LED GREEN-->Link Up at 1000Mbps
  LED ORANGE-->Transmitting or Receiving.
- (near R40) DNL
- (near U4) PHY ADDR --> 001
- (in symbol RTL8211F-CG) 10/100/1000MBit PHY
- (in symbol Title) TITLE; DATE; REVISION; DRAWN BY; PAGE; OF

### Library data of the parts
C38 C42-C46 C49 C50 C52 = CAP_0603: Capacitor SMD 0603 [C14663]; Manufacturer: *; Manufacturer Part Number: *; Distributor Link: *; LCSC: *; Rating: *; Dielectric: *
C39-C41 C47 C48 C51 = CAP_0603: Capacitor SMD 0603 [C96446]; Manufacturer: *; Manufacturer Part Number: *; Distributor Link: *; LCSC: *; Rating: *; Dielectric: *
C53 = CAP_1206: [C1846]; Manufacturer: *; Manufacturer Part Number: *; Distributor Link: *; LCSC: *; Rating: *; Dielectric: *
C54 C65 = CAP_0402: Capacitor SMD 0402 [C1548]; Manufacturer: *; Manufacturer Part Number: *; Distributor Link: *; LCSC: *; Rating: *; Dielectric: *
FB5 FB6 = FB_0603: Ferrite Bead SMD 0603[C76892]; Manufacturer: *; Manufacturer Part Number: *; Distributor Link: *; LCSC: *
J5 = HR911130A: [C54408]; Manufacturer: Hanrun; Manufacturer Part Number: HR911130A
L2 = IND_1008: [C3002540]
R7 = RES_0402: Resistor SMD 0402 [C17168]; Manufacturer: *; Manufacturer Part Number: *; Distributor Link: *; LCSC: *
R26-R29 R38 R39 = RES_0402: [C25900]; Manufacturer: *; Manufacturer Part Number: *; Distributor Link: *; LCSC: *
R30 R34 = RES_0603: [C23193]; Manufacturer: *; Manufacturer Part Number: *; Distributor Link: *; LCSC: *
R31-R33 R35-R37 = RES_0402: Resistor SMD 0402 [C25092]; Manufacturer: *; Manufacturer Part Number: *; Distributor Link: *; LCSC: *
R40 = RES_0402: Resistor SMD 0402; Manufacturer: *; Manufacturer Part Number: *; Distributor Link: *; LCSC: *
R41 R43 R45 R46 = RES_0603: [C23162]; Manufacturer: *; Manufacturer Part Number: *; Distributor Link: *; LCSC: *
R42 = RES_0603: [C22843]; Manufacturer: *; Manufacturer Part Number: *; Distributor Link: *; LCSC: *
R44 = RES_0603: [C22908]; Manufacturer: *; Manufacturer Part Number: *; Distributor Link: *; LCSC: *
U4 = RTL8211F-CG: [C187932]; Manufacturer: Realtek; Manufacturer Part Number: RTL8211F-CG
X3 = TSX-3225_24.0000MF15X-AC: as X1 on sheet KSZ - ETH HUB

## Sheet STM32 - MCU.SchDoc: ETHERNET SWITCH LAYER 2
size A3; DrawnBy: Luca Schenetti; Revision: C; SheetNumber: 5; SheetTotal: 5
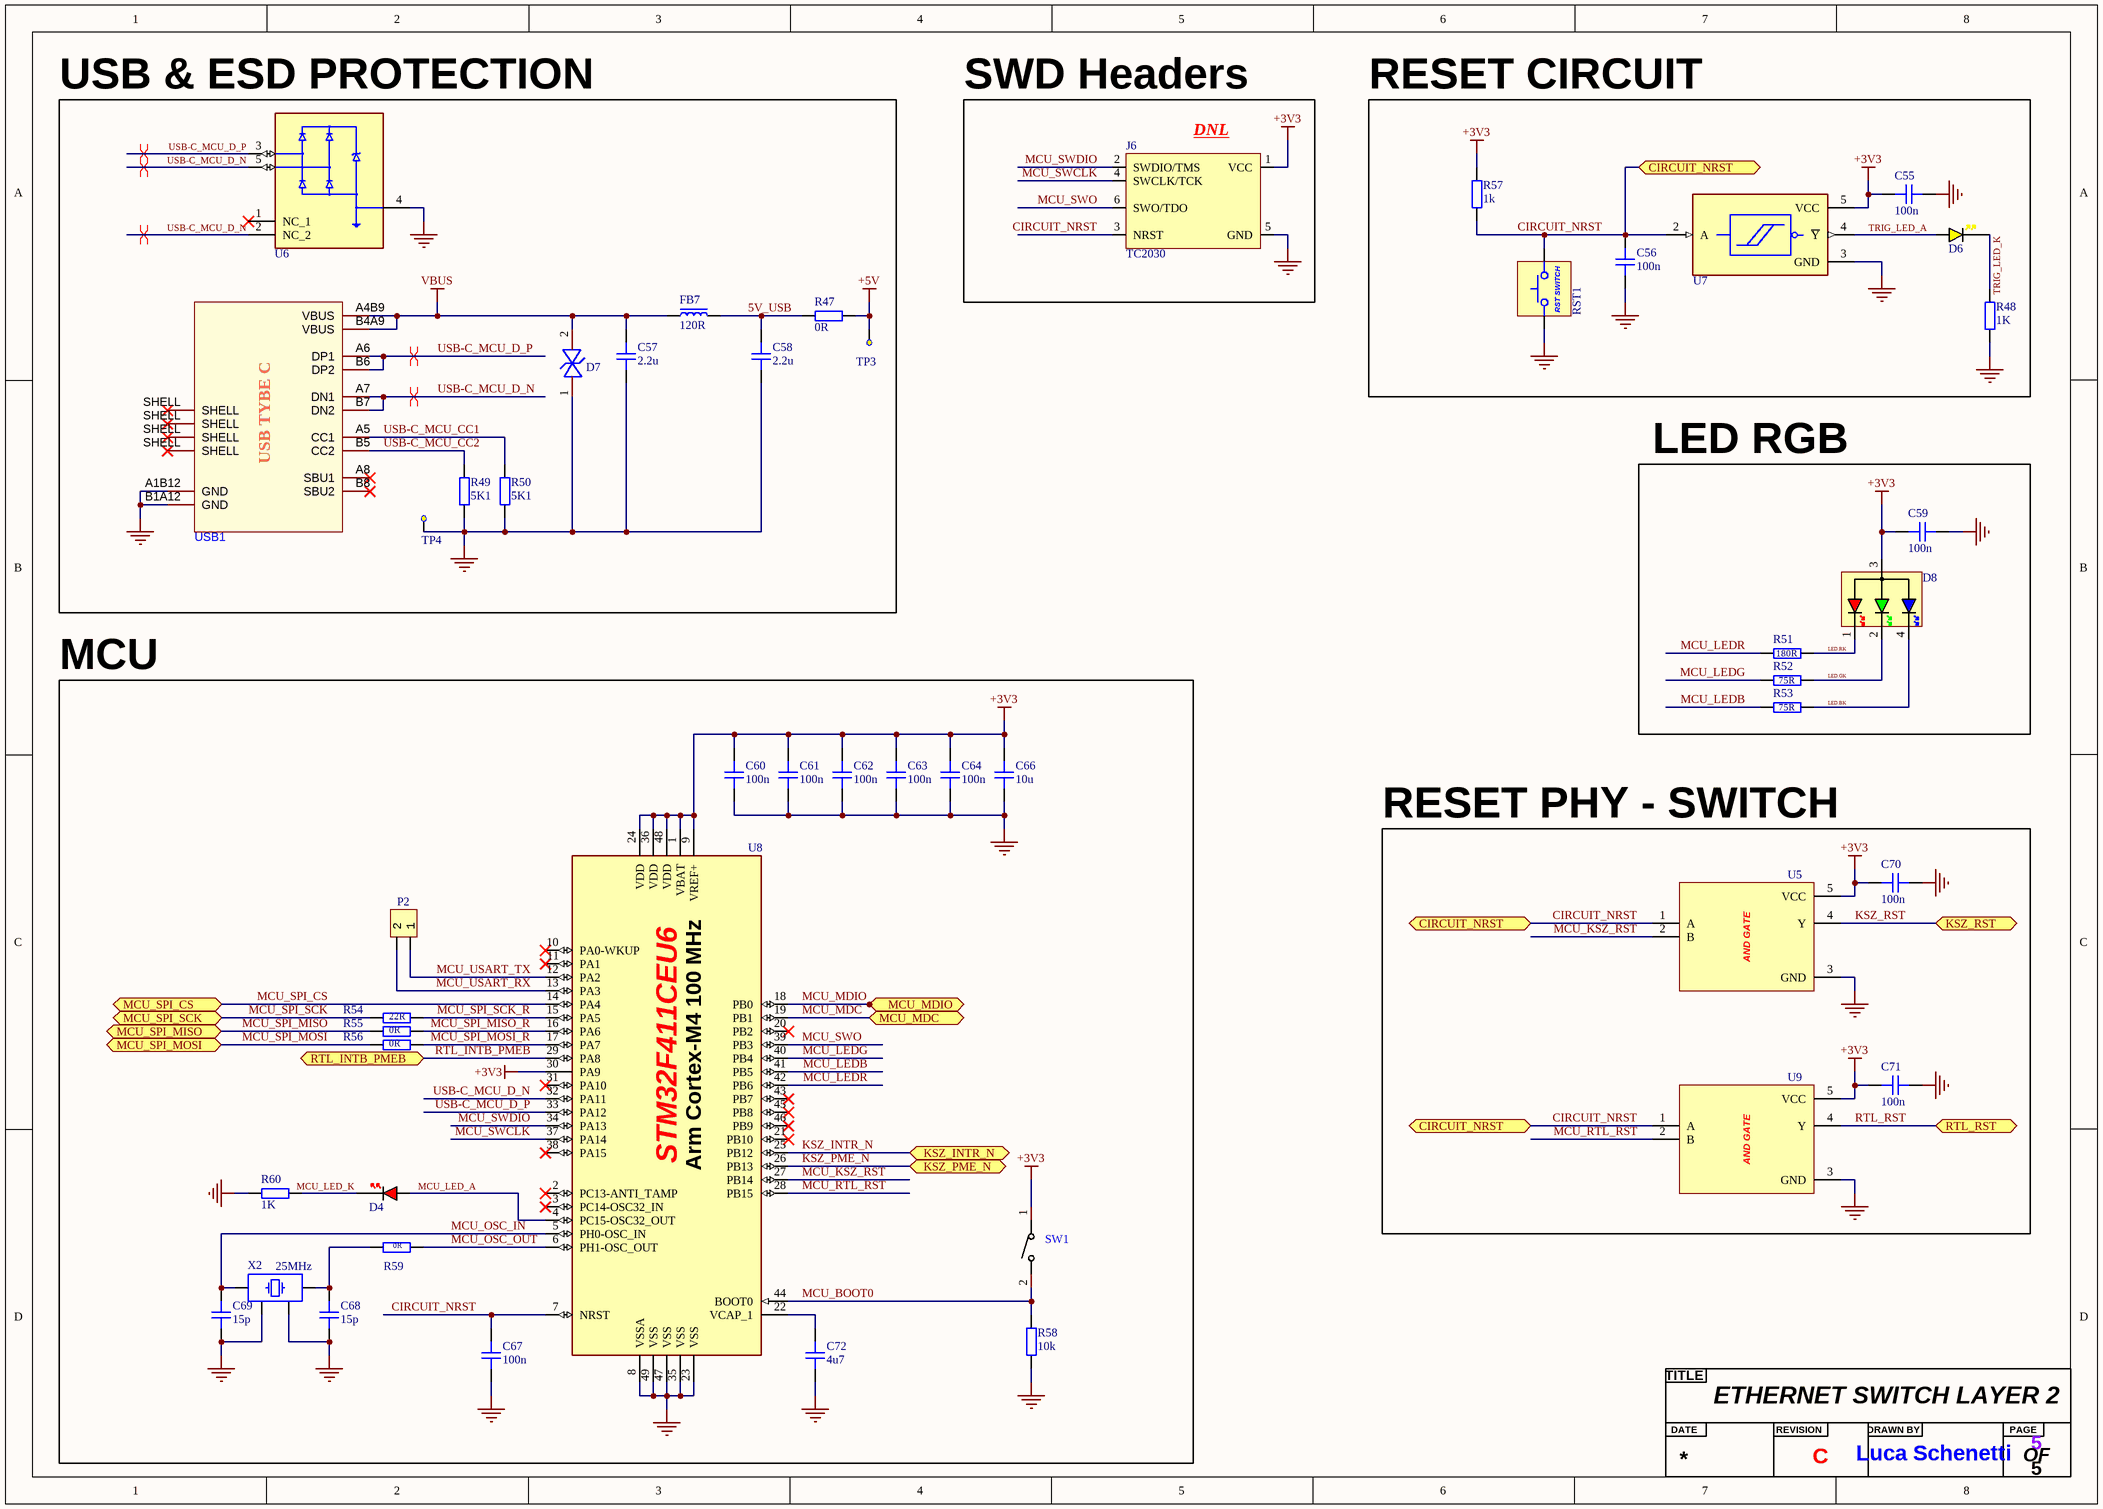
[diagram p5: STM32 - MCU.SchDoc]

### Parts
(Parts that share a designator on the sheet are numbered #1, #2 ... from top to bottom, then left to right.)
?#5  Title  (value not drawn)  (graphical)
C55  100n  [CAP_0402]
C56  100n  [CAP_0402]
C57  2.2u  [CAP_0603]
C58  2.2u  [CAP_0603]
C59  100n  [CAP_0402]
C60  100n  [CAP_0603]
C61  100n  [CAP_0603]
C62  100n  [CAP_0603]
C63  100n  [CAP_0603]
C64  100n  [CAP_0603]
C66  10u  [CAP_0603]
C67  100n  [CAP_0603]
C68  15p  [CAP_0402]
C69  15p  [CAP_0402]
C70  100n  [CAP_0402]
C71  100n  [CAP_0402]
C72  4u7  [CAP_0603]
D4  RED  [LED_0603_RED]  (value not drawn)
D6  YELLOW  [LED_0603_YELLOW]  (value not drawn)
D7  ESD Protection TVS 6.0V  [SMF6.0CA]  (value not drawn)
D8  RGB_LED  [XL-2012RGBC]  (value not drawn)
FB7  120R  [FB_0603]
J6  TC2030  [TC2030-FP]  (no BOM)
P2  HDR1x2  [HDR1X2_2.54_180]  (value not drawn)
R47  0R  [RES_0603]
R48  1K  [RES_0402]
R49  5K1  [RES_0603]
R50  5K1  [RES_0603]
R51  180R  [RES_0603]
R52  75R  [RES_0603]
R53  75R  [RES_0603]
R54  22R  [RES_0402]
R55  0R  [RES_0402]
R56  0R  [RES_0402]
R57  1k  [RES_0402]
R58  10k  [RES_0603]
R59  0R  [RES_0402]
R60  1K  [RES_0402]
RST1  RST_SWITCH_STM32  [RST_SWITCH]  (value not drawn)
SW1  TS-1088-AR02016  [TS-1088-AR02016]  (value not drawn)
TP3  Test Point  [Test Point]  (value not drawn)
TP4  Test Point  [Test Point]  (value not drawn)
U5  AND GATE  [SN74LVC1G08DBVR]  (value not drawn)
U6  TVS USB 2.0 ±25-kV  [TPD2E2U06DRLR]  (value not drawn)
U7  Schmitt Trigger 1.65V~5.5V  [74LVC1G14GW,125]  (value not drawn)
U8  ARM® Cortex®-M4 STM32F4  [STM32F411CEU6]  (value not drawn)
U9  AND GATE  [SN74LVC1G08DBVR]  (value not drawn)
USB1  USB-C CONNECTOR  [USB-3.1-SMD_U262-161N-4BVC11]  (value not drawn)
X2  25MHz  [XTAL_3225]

### Blocks framed on the sheet
USB & ESD PROTECTION: C57 C58 D7 FB7 R47 R49 R50 TP3 TP4 U6 USB1
SWD Headers: J6
RESET CIRCUIT: C55 C56 D6 R48 R57 RST1 U7
LED RGB: C59 D8 R51-R53
MCU: C60-C64 C66-C69 C72 D4 P2 R54-R56 R58-R60 SW1 U8 X2
RESET PHY - SWITCH: C70 C71 U5 U9

### Ports
CIRCUIT_NRST (bidir, see STM32 - MCU[6C]), CIRCUIT_NRST (bidir, see STM32 - MCU[6C], STM32 - MCU[7A]), KSZ_INTR_N (bidir, see KSZ - ETH HUB[1B]), KSZ_PME_N (bidir, see KSZ - ETH HUB[1B]), KSZ_RST (bidir, see KSZ - ETH HUB[3B]), MCU_MDC (bidir, see RTL - ETH PHY[1B]), MCU_MDIO (bidir, see RTL - ETH PHY[1B]), MCU_SPI_CS (bidir, see KSZ - ETH HUB[2C]), MCU_SPI_MISO (bidir, see KSZ - ETH HUB[2C]), MCU_SPI_MOSI (bidir, see KSZ - ETH HUB[2C]), MCU_SPI_SCK (bidir, see KSZ - ETH HUB[2C]), RTL_INTB_PMEB (bidir, see RTL - ETH PHY[1C]), RTL_RST (bidir, see RTL - ETH PHY[3C])

### Nets
+3V3: C55.2 C59.2 C60.2 C61.2 C62.2 C63.2 C64.2 C66.2 C70.2 C71.2 D8.3(AC) J6.1(VCC) R57.2 SW1.1 U5.5(VCC) U7.5(VCC) U8.1(VBAT) U8.9(VREF+) U8.24(VDD) U8.30(PA9) U8.36(VDD) U8.48(VDD) U9.5(VCC)
+5V: R47.2 TP3.1(Test_Point)
GND: C55.1 C56.1 C57.1 C58.1 C59.1 C60.1 C61.1 C62.1 C63.1 C64.1 C66.1 C67.1 C68.1 C69.1 C70.1 C71.1 C72.1 D7.1(C) J6.5(GND) R48.1 R49.1 R50.1 R58.1 R60.1 RST1.1 TP4.1(Test_Point) U5.3(GND) U6.4(GND) U7.3(GND) U8.8(VSSA) U8.23(VSS) U8.35(VSS) U8.47(VSS) U8.49(VSS) U9.3(GND) USB1.A1B12(GND) USB1.B1A12(GND) X2.2 X2.4
VBUS: C57.2 D7.2(A) FB7.1 USB1.A4B9(VBUS) USB1.B4A9(VBUS)
5V_USB: C58.2 FB7.2 R47.1
CIRCUIT_NRST: C56.2 C67.2 J6.3(NRST) R57.1 RST1.2 U5.1(A) U7.2(A) U8.7(NRST) U9.1(A) ; port CIRCUIT_NRST
KSZ_INTR_N: U8.25(PB12) ; port KSZ_INTR_N
KSZ_PME_N: U8.26(PB13) ; port KSZ_PME_N
KSZ_RST: U5.4(Y) ; port KSZ_RST
LED.BK: D8.4(CB) R53.1
LED.GK: D8.2(CG) R52.1
LED.RK: D8.1(CR) R51.1
MCU_BOOT0: R58.2 SW1.2 U8.44(BOOT0)
MCU_KSZ_RST: U5.2(B) U8.27(PB14)
MCU_LED_A: D4.A U8.4(PC15-OSC32_OUT)
MCU_LED_K: D4.K R60.2
MCU_LEDB: R53.2 U8.41(PB5)
MCU_LEDG: R52.2 U8.40(PB4)
MCU_LEDR: R51.2 U8.42(PB6)
MCU_MDC: U8.19(PB1) ; port MCU_MDC
MCU_MDIO: U8.18(PB0) ; port MCU_MDIO
MCU_OSC_IN: C69.2 U8.5(PH0-OSC_IN) X2.3
MCU_OSC_OUT: R59.2 U8.6(PH1-OSC_OUT)
MCU_RTL_RST: U8.28(PB15) U9.2(B)
MCU_SPI_CS: U8.14(PA4) ; port MCU_SPI_CS
MCU_SPI_MISO: R55.1 ; port MCU_SPI_MISO
MCU_SPI_MISO_R: R55.2 U8.16(PA6)
MCU_SPI_MOSI: R56.1 ; port MCU_SPI_MOSI
MCU_SPI_MOSI_R: R56.2 U8.17(PA7)
MCU_SPI_SCK: R54.1 ; port MCU_SPI_SCK
MCU_SPI_SCK_R: R54.2 U8.15(PA5)
MCU_SWCLK: J6.4(SWCLK/TCK) U8.37(PA14)
MCU_SWDIO: J6.2(SWDIO/TMS) U8.34(PA13)
MCU_SWO: J6.6(SWO/TDO) U8.39(PB3)
MCU_USART_RX: P2.2 U8.13(PA3)
MCU_USART_TX: P2.1 U8.12(PA2)
RTL_INTB_PMEB: U8.29(PA8) ; port RTL_INTB_PMEB
RTL_RST: U9.4(Y) ; port RTL_RST
TRIG_LED_A: D6.A U7.4(~{Y})
TRIG_LED_K: D6.K R48.2
USB-C_MCU_CC1: R50.2 USB1.A5(CC1)
USB-C_MCU_CC2: R49.2 USB1.B5(CC2)
USB-C_MCU_D_N: U6.2(NC_2) U6.5(IO2) U8.32(PA11) USB1.A7(DN1) USB1.B7(DN2)
USB-C_MCU_D_P: U6.3(IO1) U8.33(PA12) USB1.A6(DP1) USB1.B6(DP2)
NetC68_2: C68.2 R59.1 X2.1
NetC72_2: C72.2 U8.22(VCAP_1)

Not connected (* = marked no-connect by the designer): U6 1(NC_1)*; U8 2(PC13-ANTI_TAMP)* 3(PC14-OSC32_IN)* 10(PA0-WKUP)* 11(PA1)* 20(PB2)* 21(PB10)* 31(PA10)* 38(PA15)* 43(PB7)* 45(PB8)* 46(PB9)*; USB1 A8(SBU1)* B8(SBU2)* SHELL*

### Layout directives
differential pair; differential pair class DIFF_USB_90Ω: USB-C_MCU_D_N, USB-C_MCU_D_P

### Notes on the sheet
- (near J6) DNL
- (in symbol RST_SWITCH) RST SWITCH
- (in symbol STM32F411CEU6) Arm Cortex-M4 100 MHz
- (in symbol Title) TITLE; DATE; REVISION; DRAWN BY; PAGE; OF
- (in symbol U262-161N-4BVC11) USB TYBE C

### Library data of the parts
C55 C56 C59 C70 C71 = CAP_0402: Capacitor SMD 0402 [C1525]; Manufacturer: *; Manufacturer Part Number: *; Distributor Link: *; LCSC: *; Rating: *; Dielectric: *
C57 C58 = CAP_0603: Capacitor SMD 0603 [C23630]; Manufacturer: *; Manufacturer Part Number: *; Distributor Link: *; LCSC: *; Rating: *; Dielectric: *
C60-C64 C67 = CAP_0603: Capacitor SMD 0603 [C14663]; Manufacturer: *; Manufacturer Part Number: *; Distributor Link: *; LCSC: *; Rating: *; Dielectric: *
C66 = CAP_0603: Capacitor SMD 0603 [C96446]; Manufacturer: *; Manufacturer Part Number: *; Distributor Link: *; LCSC: *; Rating: *; Dielectric: *
C68 C69 = CAP_0402: Capacitor SMD 0402 [C1548]; Manufacturer: *; Manufacturer Part Number: *; Distributor Link: *; LCSC: *; Rating: *; Dielectric: *
C72 = CAP_0603: Capacitor SMD 0603 [C19666]; Manufacturer: *; Manufacturer Part Number: *; Distributor Link: *; LCSC: *; Rating: *; Dielectric: *
D4 = LED_0603_RED: LED 0603 RED SMD[C2926776]
D6 = LED_0603_YELLOW: LED 0603 YELLOW SMD[C72038]
D7 = SMF6.0CA: [C2990473]
D8 = RGB_LED_0805: [C965848]
FB7 = FB_0603: Ferrite Bead SMD 0603[C76892]; Manufacturer: *; Manufacturer Part Number: *; Distributor Link: *; LCSC: *
J6 = TC2030: Tag-Connect No-Solder SWD Debug Connector DO NOT PLACE; Manufacturer: Tag-Connect; Manufacturer Part Number: TC2030
P2 = HDR1x2_2.54T: Header; Value: 2.54; Type: DIP 1x2
R47 = RES_0603: [C21189]; Manufacturer: *; Manufacturer Part Number: *; Distributor Link: *; LCSC: *
R48 R57 R60 = RES_0402: Resistor SMD 0402 [C11702]; Manufacturer: *; Manufacturer Part Number: *; Distributor Link: *; LCSC: *
R49 R50 = RES_0603: [C23186]; Manufacturer: *; Manufacturer Part Number: *; Distributor Link: *; LCSC: *
R51 = RES_0603: [C22828]; Manufacturer: *; Manufacturer Part Number: *; Distributor Link: *; LCSC: *
R52 R53 = RES_0603: [C4275]; Manufacturer: *; Manufacturer Part Number: *; Distributor Link: *; LCSC: *
R54 = RES_0402: Resistor SMD 0402 [C25092]; Manufacturer: *; Manufacturer Part Number: *; Distributor Link: *; LCSC: *
R55 R56 R59 = RES_0402: Resistor SMD 0402 [C17168]; Manufacturer: *; Manufacturer Part Number: *; Distributor Link: *; LCSC: *
R58 = RES_0603: Resistor SMD 0603[C25804]; Manufacturer: *; Manufacturer Part Number: *; Distributor Link: *; LCSC: *
RST1 = RST_SWITCH: [C720477]
SW1 = TS-1088-AR02016: [C720477]; Manufacturer: XUNPU(讯普); Add into BOM: yes; Circuit: SPST; Actuator Style: Round Button; Operating Force: 160gf; Switch Length: 4mm; Switch Width: 3mm; Switch Height: 2mm; Strike Gundam: 不带; Contact Current: 50mA; Voltage Rating (DC): 12V; Insulation Resistance: 100MΩ; Actuator/Cap Color: Black; Pin Style: SMDSplicing; Mechanical Life: 10万次; Symbol: TS-1088-AR02016; Device: TS-1088-AR02016; Supplier: LCSC; Supplier Part: C720477; Manufacturer Part: TS-1088-AR02016; JLCPCB Part Class: Extended Part; LCSC Part Name: 4*3*2mm 立贴 轻触开关; Supplier Footprint: SMD; Datasheet: https://atta.szlcsc.com/upload/public/pdf/source/20200810/C720475_60D09DD6C54279ADDB2DC25100F1CC11.pdf; Convert to PCB: yes; Mounting Style: Brick nogging; Operating Temperature: -30℃~+80℃
U5 U9 = SN74LVC1G08DBVR: [C7666]
U6 = TPD2E2U06DRLR: [C1972959]
U7 = 74LVC1G14GW,125: [C265125]
U8 = STM32F411CEU6: [C60420]
USB1 = U262-161N-4BVC11: [C319148]; Manufacturer: XKB Connectivity(中国星坤); Symbol: U262-16XN-4BVC11; Add into BOM: yes; Connector Type: Type-C; Gender: Female; Number of Ports: 1; Number of Contacts: 16P; Current Rating - Power (Max): 3A; Soldering Temperature(Max): 260℃; Device: U262-161N-4BVC11; LCSC Part Name: Type-C 母 卧贴; Supplier Part: C319148; Manufacturer Part: U262-161N-4BVC11; Supplier Footprint: SMD; JLCPCB Part Class: Extended Part; Datasheet: https://atta.szlcsc.com/upload/public/pdf/source/20211015/B478CBA0F1623DA36A6CC6918C49C838.pdf; Supplier: LCSC; Convert to PCB: yes; Standard: USB 3.1; Mounting Style: 卧贴; Contact Material: Copper Alloy; Contact Plating: Gold; Operating Temperature Range: -40℃~+85℃
X2 = TSX-3225_24.0000MF15X-AC: as X1 on sheet KSZ - ETH HUB
TP3 TP4 = Test Point: Value: Test Point

## Nets that join several sheets
+1V2: POWER RAIL (C2.2 TP1.1 U1.2), KSZ - ETH HUB (FB1.1 FB3.1)
+3V3: POWER RAIL (9 pins), KSZ - ETH HUB (13 pins), RTL - ETH PHY (11 pins), STM32 - MCU (23 pins)
+5V: POWER RAIL (D1.A), STM32 - MCU (R47.2 TP3.1)
GND: POWER RAIL (13 pins), KSZ - ETH HUB (44 pins), RTL - ETH PHY (30 pins), STM32 - MCU (39 pins)
KSZ_GTXC5: KSZ - ETH HUB (U3.43), RTL - ETH PHY (R37.1)
KSZ_INTR_N: KSZ - ETH HUB (R6.1 U3.23), STM32 - MCU (U8.25)
KSZ_PME_N: KSZ - ETH HUB (R5.1 U3.56), STM32 - MCU (U8.26)
KSZ_RST: KSZ - ETH HUB (U3.72), STM32 - MCU (U5.4)
KSZ_TXD5_0: KSZ - ETH HUB (U3.30), RTL - ETH PHY (R31.1)
KSZ_TXD5_1: KSZ - ETH HUB (U3.32), RTL - ETH PHY (R32.1)
KSZ_TXD5_2: KSZ - ETH HUB (U3.35), RTL - ETH PHY (R33.1)
KSZ_TXD5_3: KSZ - ETH HUB (U3.36), RTL - ETH PHY (R35.1)
KSZ_TXD5_CTL: KSZ - ETH HUB (U3.29), RTL - ETH PHY (R36.1)
MCU_MDC: RTL - ETH PHY (U4.13), STM32 - MCU (U8.19)
MCU_MDIO: RTL - ETH PHY (R42.1 U4.14), STM32 - MCU (U8.18)
MCU_SPI_CS: KSZ - ETH HUB (R23.1 U3.69), STM32 - MCU (U8.14)
MCU_SPI_MISO: KSZ - ETH HUB (R25.2 U3.66), STM32 - MCU (R55.1)
MCU_SPI_MOSI: KSZ - ETH HUB (U3.68), STM32 - MCU (R56.1)
MCU_SPI_SCK: KSZ - ETH HUB (U3.67), STM32 - MCU (R54.1)
RTL_INTB_PMEB: RTL - ETH PHY (R41.1 U4.31), STM32 - MCU (U8.29)
RTL_RST: RTL - ETH PHY (U4.12), STM32 - MCU (U9.4)
RTL_TX_CTL: KSZ - ETH HUB (R15.1), RTL - ETH PHY (U4.19)
RTL_TXC: KSZ - ETH HUB (R8.1), RTL - ETH PHY (U4.20)
RTL_TXD_0: KSZ - ETH HUB (R9.1), RTL - ETH PHY (U4.18)
RTL_TXD_1: KSZ - ETH HUB (R10.1), RTL - ETH PHY (U4.17)
RTL_TXD_2: KSZ - ETH HUB (R11.1), RTL - ETH PHY (U4.16)
RTL_TXD_3: KSZ - ETH HUB (R13.1), RTL - ETH PHY (U4.15)